# EAGLE schematic datalogger_v01_1284 (EAGLE 7.2.0)
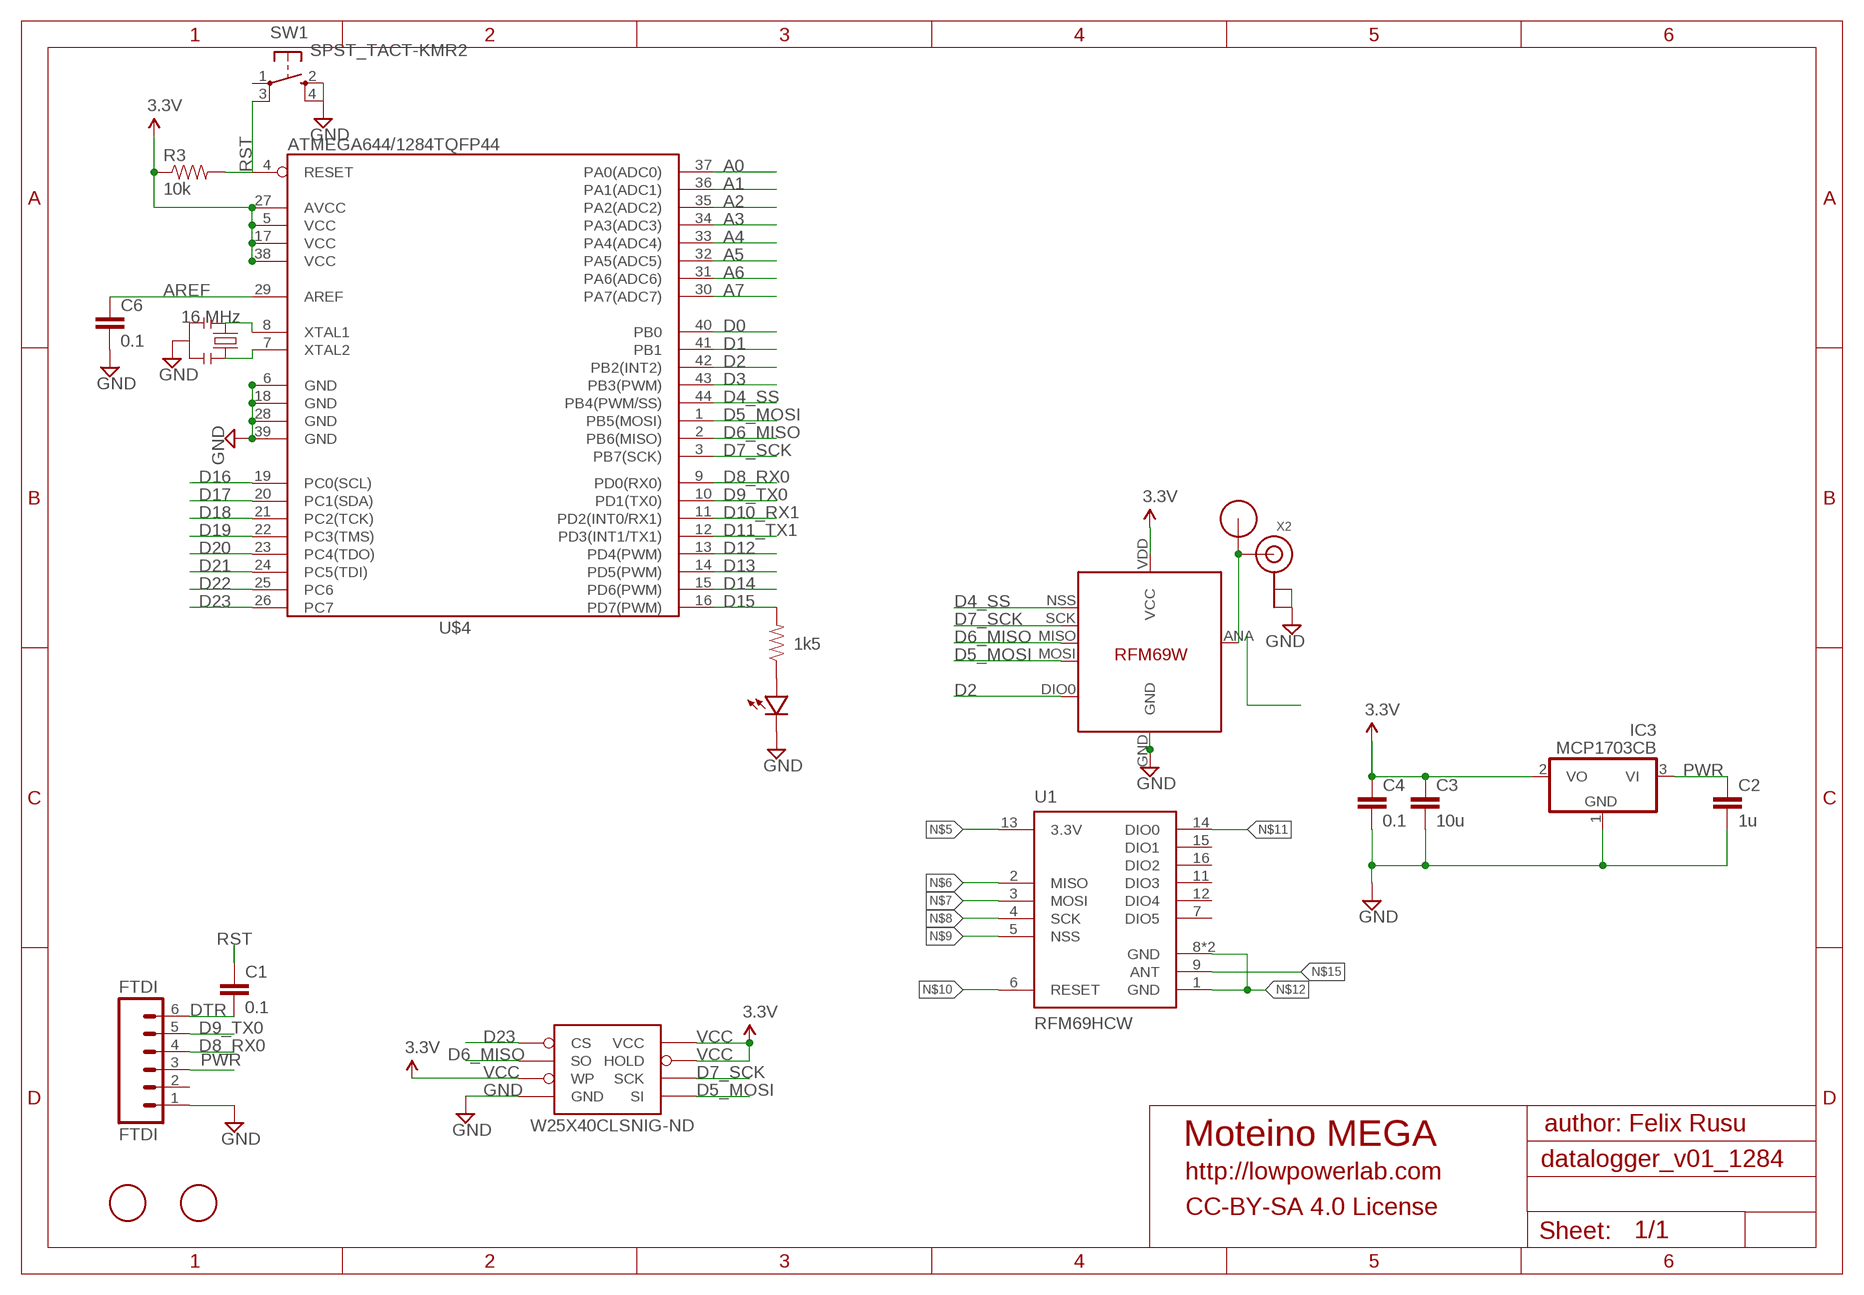
[diagram p0: schematic, sheet 1]

## Parts
C1  0.1  CAP0603-CAP  [0603-CAP]
C2  1u  CAP0603-CAP  [0603-CAP]
C3  10u  CAP0805-CAP  [0805-CAP]
C4  0.1  CAP0603-CAP  [0603-CAP]
C6  0.1  CAP0603-CAP  [0603-CAP]
FTDI  FTDI  M06SIP  [1X06]
IC3  MCP1703CB  [SOT23]
R2  1k5  RESISTOR0603-RES  [0603-RES]
R3  10k  RESISTOR0603-RES  [0603-RES]
SW1  SPST_TACT-KMR2  [KMR2]
U1  RFM69HCW  [RFM69HCW-XXXS2]
U$1  RFM12B_ANTENNA  [RFM12B-ANTENNA]
U$2  FIDUCIAL  [FIDUCIAL_1MM]
U$4  ATMEGA644/1284TQFP44  [TQFP44]
U$5  RFM69  [RFM69W-MINPADS]
U$6  LED0603  [0603-LED]
U$7  FIDUCIAL  [FIDUCIAL_1MM]
W25X40CLSNIG-ND  AT25F512BWIDE_5.3MM  [SO08WIDE]
X1  16 MHz  RESONATORSMD  [RESONATOR-SMD]
X2  ANTENNA_U.FL  [U.FL]

## Nets
A0: U$4.37(PA0(ADC0))
A1: U$4.36(PA1(ADC1))
A2: U$4.35(PA2(ADC2))
A3: U$4.34(PA3(ADC3))
A4: U$4.33(PA4(ADC4))
A5: U$4.32(PA5(ADC5))
A6: U$4.31(PA6(ADC6))
A7: U$4.30(PA7(ADC7))
AREF: C6.1 U$4.29(AREF)
D0: U$4.40(PB0)
D1: U$4.41(PB1)
D2: U$4.42(PB2(INT2)) U$5.DIO0
D3: U$4.43(PB3(PWM))
D4_SS: U$4.44(PB4(PWM/SS)) U$5.NSS(SEL)
D5_MOSI: U$4.1(PB5(MOSI)) U$5.MOSI W25X40CLSNIG-ND.5(SI)
D6_MISO: U$4.2(PB6(MISO)) U$5.MISO W25X40CLSNIG-ND.2(SO)
D7_SCK: U$4.3(PB7(SCK)) U$5.SCK W25X40CLSNIG-ND.6(SCK)
D8_RX0: FTDI.4 U$4.9(PD0(RX0))
D9_TX0: FTDI.5 U$4.10(PD1(TX0))
D10_RX1: U$4.11(PD2(INT0/RX1))
D11_TX1: U$4.12(PD3(INT1/TX1))
D12: U$4.13(PD4(PWM))
D13: U$4.14(PD5(PWM))
D14: U$4.15(PD6(PWM))
D15: R2.2 U$4.16(PD7(PWM))
D16: U$4.19(PC0(SCL))
D17: U$4.20(PC1(SDA))
D18: U$4.21(PC2(TCK))
D19: U$4.22(PC3(TMS))
D20: U$4.23(PC4(TDO))
D21: U$4.24(PC5(TDI))
D22: U$4.25(PC6)
D23: U$4.26(PC7) W25X40CLSNIG-ND.1(CS)
DTR: C1.2 FTDI.6
GND [power]: C2.2 C3.2 C4.2 C6.2 FTDI.1 IC3.1(GND) SW1.2(S) SW1.4(S1) U$4.6(GND) U$4.18(GND) U$4.28(GND) U$4.39(GND) U$5.GND U$6.MINUS W25X40CLSNIG-ND.4(GND) X1.2 X2.1(GND) X2.2(GND)
N$1: U$4.8(XTAL1) X1.1
N$2: R2.1 U$6.PLUS
N$3: U$1.P$1 U$5.ANA(ANT) X2.3(SIGNAL)
N$4: U$4.7(XTAL2) X1.3
N$5: U1.13(3.3V)
N$6: U1.2(MISO)
N$7: U1.3(MOSI)
N$8: U1.4(SCK)
N$9: U1.5(NSS)
N$10: U1.6(RESET)
N$11: U1.14(DIO0)
N$12: U1.1(GND) U1.8(GND) U1.10(GND)
N$15: U1.9(ANT)
PWR [power]: C2.1 FTDI.3 IC3.3(VI)
RST: C1.1 R3.2 SW1.3(P1) U$4.4(RESET)
VCC: C3.1 C4.1 IC3.2(VO) R3.1 U$4.5(VCC) U$4.17(VCC) U$4.27(AVCC) U$4.38(VCC) U$5.VDD(VCC) W25X40CLSNIG-ND.3(WP) W25X40CLSNIG-ND.7(HOLD) W25X40CLSNIG-ND.8(VCC) ; supply symbol labelled 3.3V
Unconnected: FTDI.2 SW1.1(P) U1.7(DIO5) U1.11(DIO3) U1.12(DIO4) U1.15(DIO1) U1.16(DIO2)

## Notes on the sheet
- author: Felix Rusu
- Moteino MEGA
- http://lowpowerlab.com
- CC-BY-SA 4.0 License

## Library data of the parts
C1-C4 C6 = LowPowerLab:CAP: Capacitor Standard 0603 ceramic capacitor, and 0.1" leaded capacitor.
FTDI = SparkFun-Connectors:M06: Header 6 Standard 6-pin 0.1" header. Use with straight break away headers (SKU : PRT-00116), right angle break away headers (PRT-00553), swiss pins (PRT-00743), machine pins (PRT-00117), and female headers (PRT-00115). Molex polarized connector foot print use with SKU : PRT-08094 with associated crimp pins and housings. NOTES ON THE VARIANTS LOCK and LOCK_LONGPADS... This footprint was designed to help hold the alignment of a through-hole component (i.e. 6-pin header) while soldering it into place. You may notice that each hole has been shifted either up or down by 0.005 of an inch from it's more standard position (which is a perfectly straight line). This slight alteration caused the pins (the squares in the middle) to touch the edges of the holes. Because they are alternating, it causes a "brace" to hold the component in place. 0.005 has proven to be the perfect amount of "off-center" position when using our standard breakaway headers. Although looks a little odd when you look at the bare footprint, once you have a header in there, the alteration is very hard to notice. Also, if you push a header all the way into place, it is covered up entirely on the bottom side. This idea of altering the position of holes to aid alignment will be further integrated into the Sparkfun Library for other footprints. It can help hold any component with 3 or more connection pins.
IC3 = linear:MCP1703: 250 mA, 16V, Low Quiescent Current LDO Regulator Source: http://ww1.microchip.com/downloads/en/DeviceDoc/22049b.pdf
R2 R3 = LowPowerLab:RESISTOR: Resistor Basic schematic elements and footprints for 0603, 1206, and PTH resistors.
SW1 = adafruit:SPST_TACT: SMT 6mm switch, EVQQ2 series http://www.ladyada.net/library/eagle
U1 = SparkFun-RF:RFM69H; PROD_ID: IC-11997, IC-12053
U$1 = LowPowerLab:RFM12B_ANTENNA
U$2 U$7 = adafruit:FIDUCIAL: For use by pick and place machines to calibrate the vision/machine, 1mm By microbuilder.eu
U$4 = LowPowerLab:ATMEGA644/1284
U$5 = LowPowerLab:RFM69
U$6 = LowPowerLab:LED
W25X40CLSNIG-ND = LowPowerLab:AT25F512B: 4-Mbit SPI flash memory
X1 = SparkFun:RESONATOR: Resonator Small SMD resonator. This is the itty bitty 10/20MHz resonators with built in caps. CSTCE10M0G55 and CSTCE20M0V53. Footprint has been reviewed closely but hasn't been tested yet.
X2 = adafruit:ANTENNA_U.FL: U.FL Antenna Connector

## Net classes
1 power: width 0.381 mm, clearance 0.254 mm